# EAGLE design mbml (EAGLE 7.6.0)
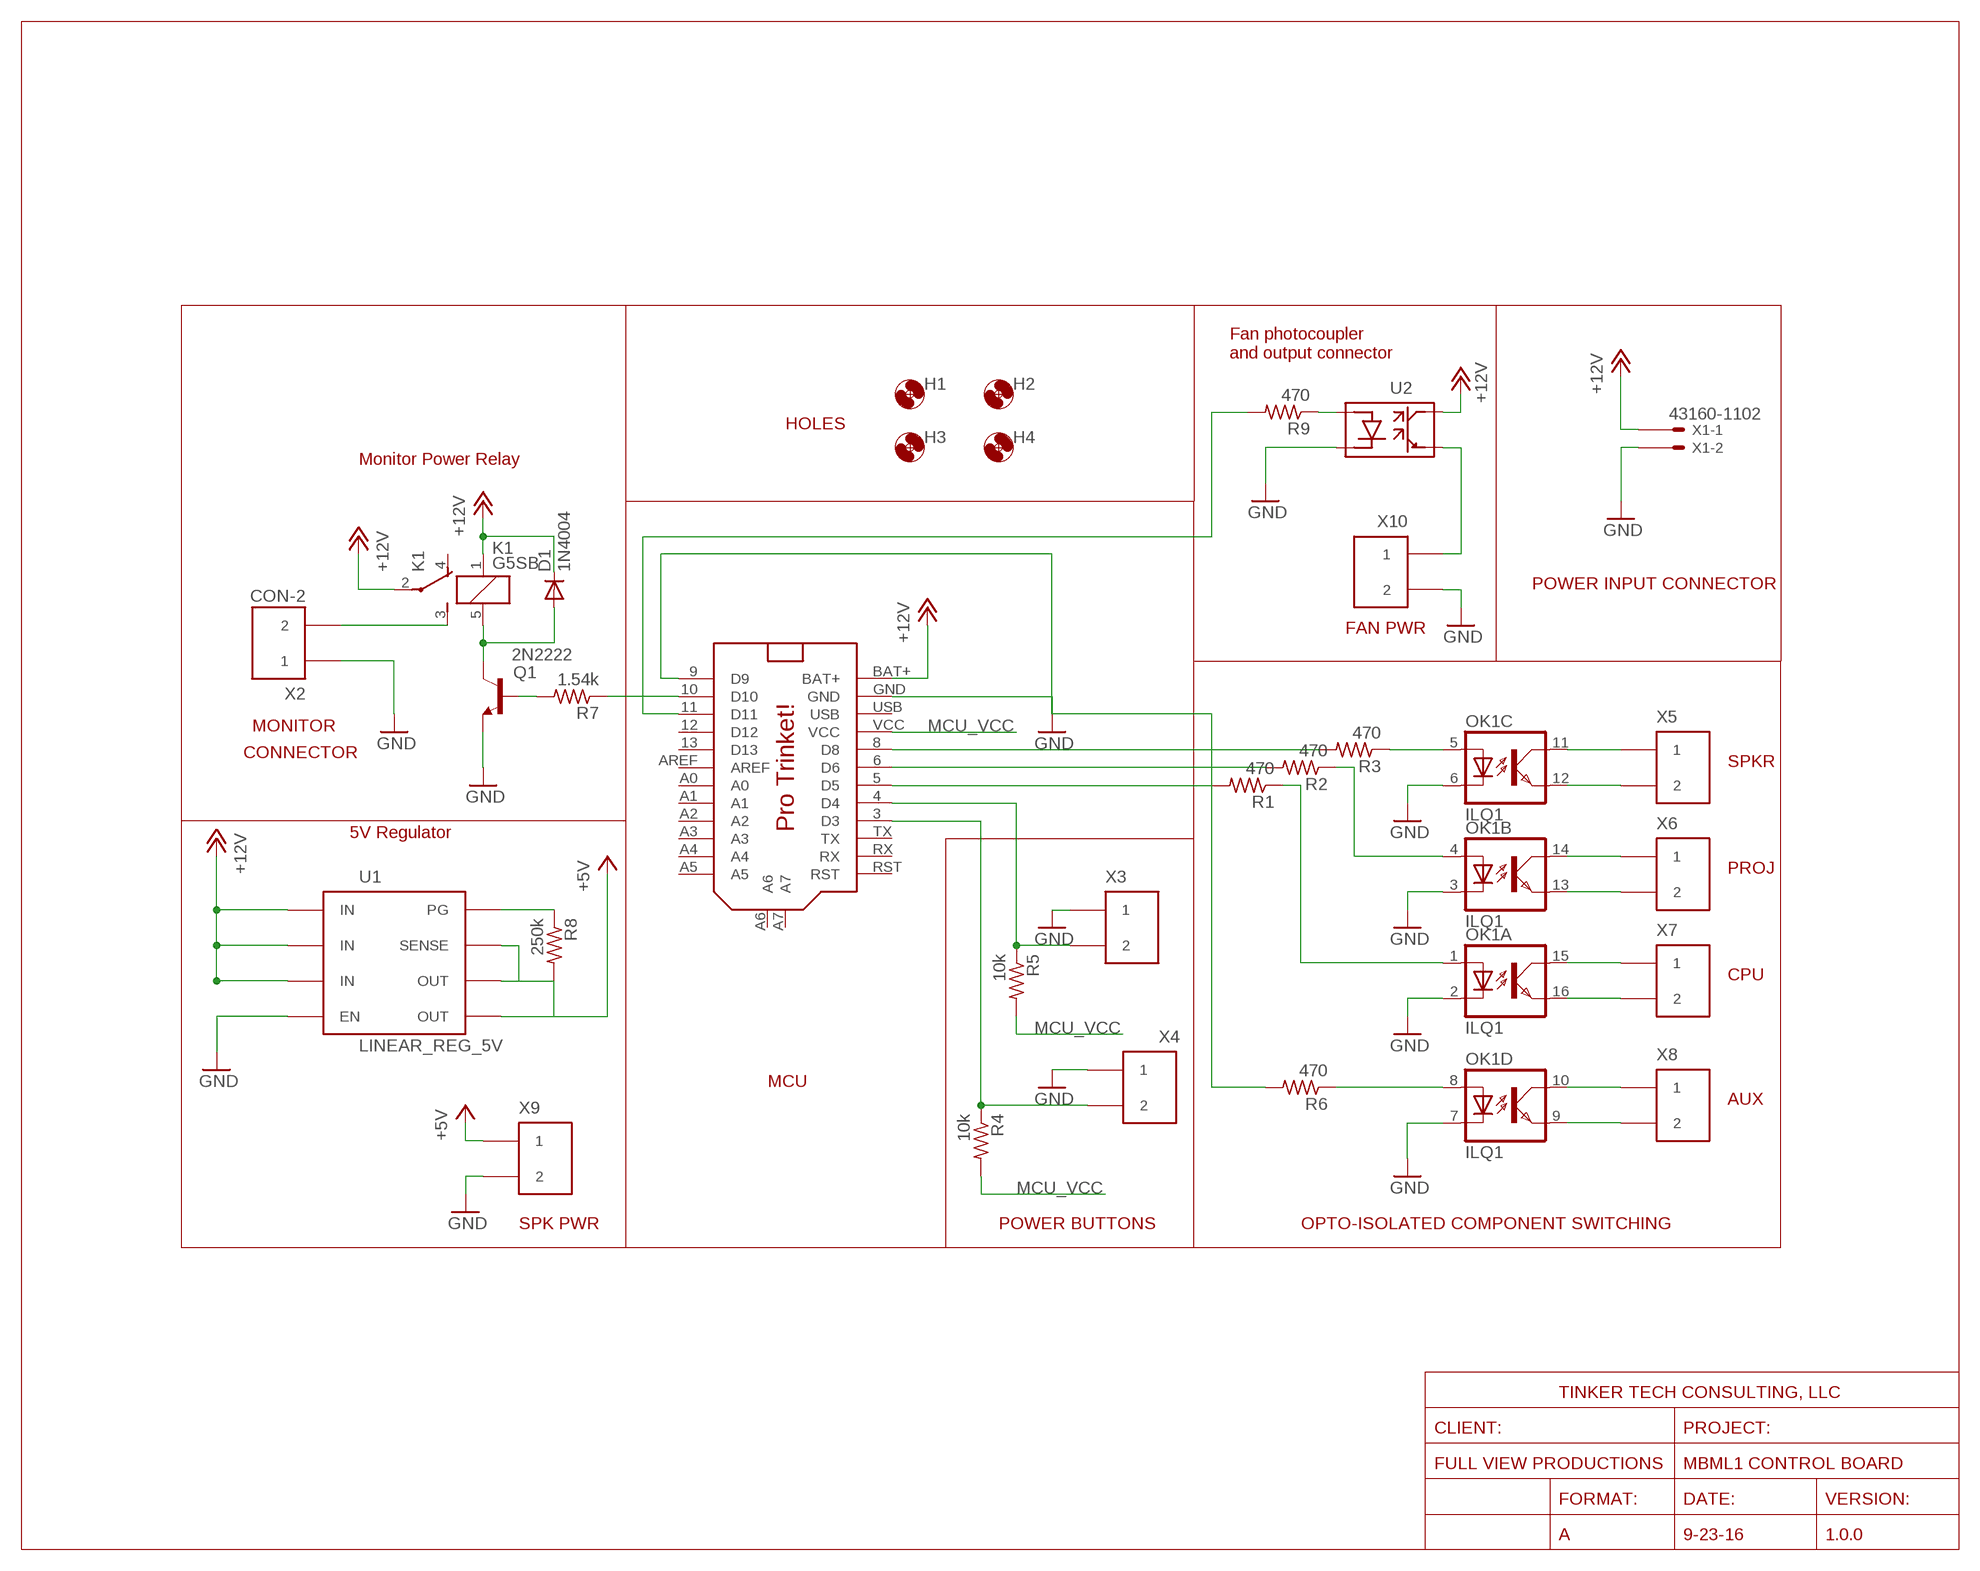
[diagram p0: schematic, sheet 1]

## Parts
D1  1N4004  [DO41-10]
H1  MOUNT-HOLE3.0  [3,0]
H2  MOUNT-HOLE3.0  [3,0]
H3  MOUNT-HOLE3.0  [3,0]
H4  MOUNT-HOLE3.0  [3,0]
K1  G5SB  [G5SB]
OK1  ILQ1  [DIL16]
Q1  2N2222  [TO18]
R1  470  R-US_0204/5  [0204/5]
R2  470  R-US_0204/5  [0204/5]
R3  470  R-US_0204/5  [0204/5]
R4  10k  R-US_0204/5  [0204/5]
R5  10k  R-US_0204/5  [0204/5]
R6  470  R-US_0204/5  [0204/5]
R7  1.54k  R-US_0204/5  [0204/5]
R8  250k  R-US_0204/5  [0204/5]
R9  470  R-US_0204/5  [0204/5]
U1  LINEAR_REG_5V  [DIP-8]
U2  PHOTOCOUPLER  [DIP-4]
U$1  PRO_TRINKET  [PROTRINKET]
X1  43160-1102  [43160-XX02]
X2  CON-2  [MOLEX_MEGA-FIT_2]
X3  CON-2B2B-XH-A(LF)(SN)  [CON_2-2.5MM_TH]
X4  CON-2B2B-XH-A(LF)(SN)  [CON_2-2.5MM_TH]
X5  CON-2B2B-XH-A(LF)(SN)  [CON_2-2.5MM_TH]
X6  CON-2B2B-XH-A(LF)(SN)  [CON_2-2.5MM_TH]
X7  CON-2B2B-XH-A(LF)(SN)  [CON_2-2.5MM_TH]
X8  CON-2B2B-XH-A(LF)(SN)  [CON_2-2.5MM_TH]
X9  CON-2B2B-XH-A(LF)(SN)  [CON_2-2.5MM_TH]
X10  CON-2B2B-XH-A(LF)(SN)  [CON_2-2.5MM_TH]

## Nets
+5V: R8.2 U1.5(OUT) U1.6(OUT) U1.7(SENSE) X9.P$1
+12V: D1.C K1.1 K1.2(U:P) U1.1(IN) U1.2(IN) U1.3(IN) U2.4 U$1.BAT+ X1.1@1(-1:S)
GND: OK1.2(A:C) OK1.3(B:C) OK1.6(C:C) OK1.7(D:C) Q1.1(E) U1.4(EN) U2.2 U$1.GND X1.2@1(-2:S) X2.P$1 X3.P$1 X4.P$1 X9.P$2 X10.P$2
MCU_VCC: R4.2 R5.2 U$1.VCC
MON_PWR: K1.3(U:S) X2.P$2
N$1: R4.1 U$1.3(D3) X4.P$2
N$2: R5.1 U$1.4(D4) X3.P$2
N$3: D1.A K1.5 Q1.3(C)
N$4: R1.2 U$1.5(D5)
N$5: Q1.2(B) R7.2
N$6: OK1.5(C:A) R3.1
N$7: OK1.4(B:A) R2.1
N$8: OK1.1(A:A) R1.1
N$9: R2.2 U$1.6(D6)
N$10: R3.2 U$1.8(D8)
N$11: OK1.11(C:COL) X5.P$1
N$12: OK1.12(C:EMIT) X5.P$2
N$13: OK1.14(B:COL) X6.P$1
N$14: OK1.13(B:EMIT) X6.P$2
N$15: OK1.15(A:COL) X7.P$1
N$16: OK1.16(A:EMIT) X7.P$2
N$17: OK1.8(D:A) R6.1
N$18: R6.2 U$1.9(D9)
N$19: OK1.10(D:COL) X8.P$1
N$20: OK1.9(D:EMIT) X8.P$2
N$35: R7.1 U$1.10(D10)
N$46: R9.1 U2.1
N$47: R9.2 U$1.11(D11)
N$48: R8.1 U1.8(PG)
N$49: U2.3 X10.P$1
Unconnected: K1.4(U:O) U$1.12(D12) U$1.13(D13) U$1.A0 U$1.A1 U$1.A2 U$1.A3 U$1.A4 U$1.A5 U$1.A6 U$1.A7 U$1.AREF U$1.RST U$1.RX U$1.TX X1.1@2(-1:S) X1.2@2(-2:S)

## Notes on the sheet
- Fan photocoupler
  and output connector
- HOLES
- Monitor Power Relay
- POWER INPUT CONNECTOR
- FAN PWR
- MONITOR
- CONNECTOR
- SPKR
- 5V Regulator
- PROJ
- CPU
- MCU
- AUX
- SPK PWR | POWER BUTTONS | OPTO-ISOLATED COMPONENT SWITCHING
- TINKER TECH CONSULTING, LLC
- CLIENT: | PROJECT:
- FULL VIEW PRODUCTIONS | MBML1 CONTROL BOARD
- FORMAT: | DATE: | VERSION:
- A | 9-23-16 | 1.0.0

## Power pins joined to a net without a drawn wire
USB: U$1.USB

## Library data of the parts
D1 = diode:1N4004: DIODE general purpose rectifier, 1 A
H1-H4 = holes:MOUNT-HOLE: MOUNTING HOLE with drill center marker
K1 = relay:G5SB: Compact Single-pole Relay for Switching 5 A Source: http://www.omron.com/ecb/products/pry/121/g5sb.html; OC_FARNELL: unknown; OC_NEWARK: unknown
OK1 = optocoupler:ILQ1: SIEMENS OPTO COUPLER; MF: VISHAY/TELEFUNKEN; MPN: ILQ1; OC_FARNELL: 1469501; OC_NEWARK: 88K1954
Q1 = transistor-npn:2N2222*: NPN Transistor
R1-R9 = resistor:R-US_: RESISTOR, American symbol
U1 = TinkerTech:LINEAR_REG_5V
U2 = TinkerTech:PHOTOCOUPLER
U$1 = adafruit_9-22-16:PRO_TRINKET
X1 = con-molex:43160-*02: SDA-43160 Connector Source: http://www.molex.com/pdm_docs/sd/431601306_sd.pdf; MF: WALDOM/MOLEX; MPN: 43160-1102; OC_FARNELL: unknown; OC_NEWARK: 54H0255
X2-X10 = FVP:CON-2

## Net classes
1 mon_pwr: width 1.27 mm, clearance 0.508 mm

## Board
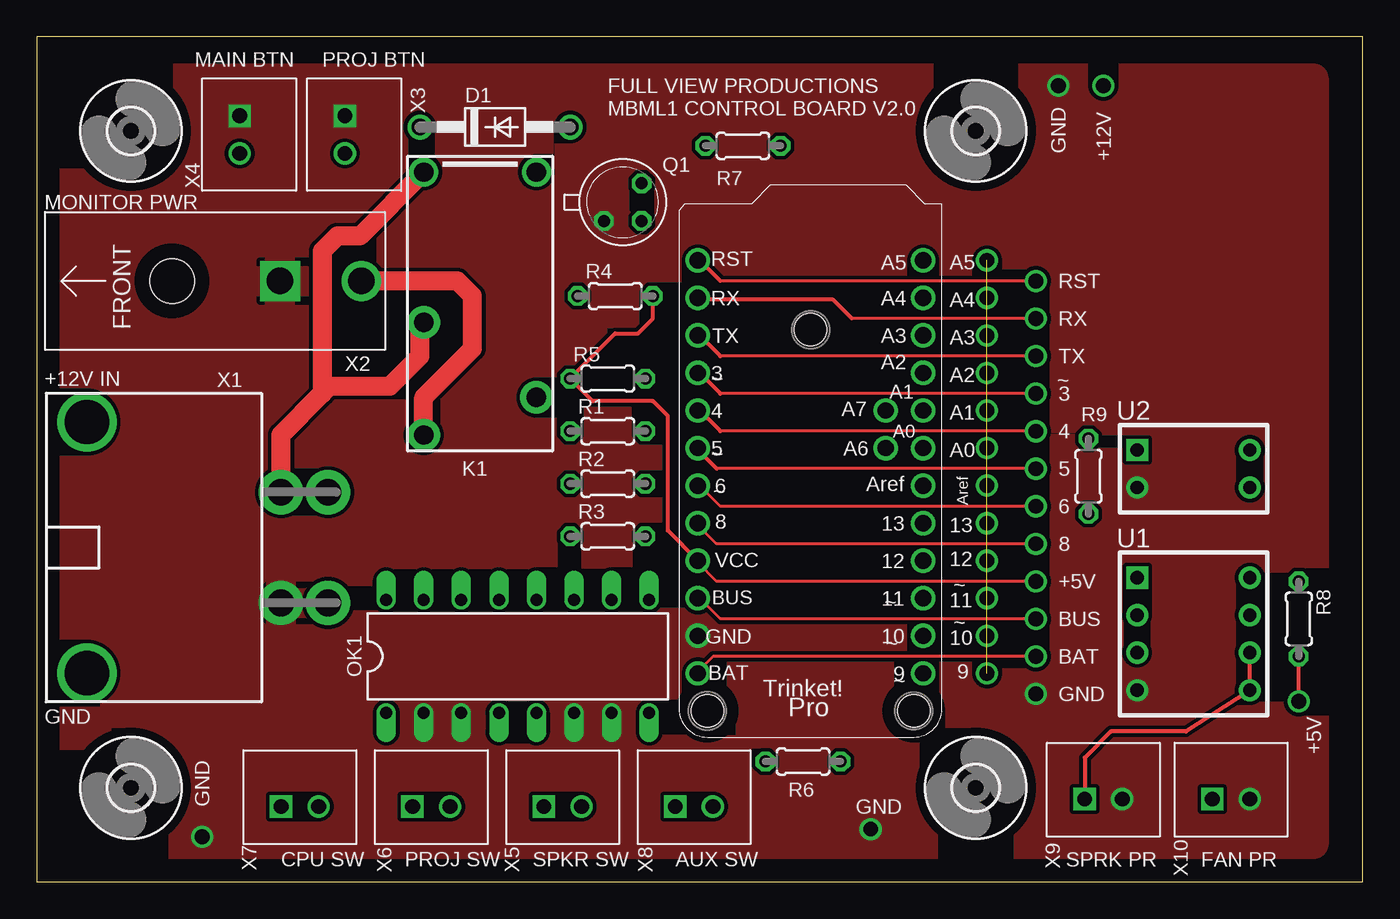
[diagram p1: board, top side]
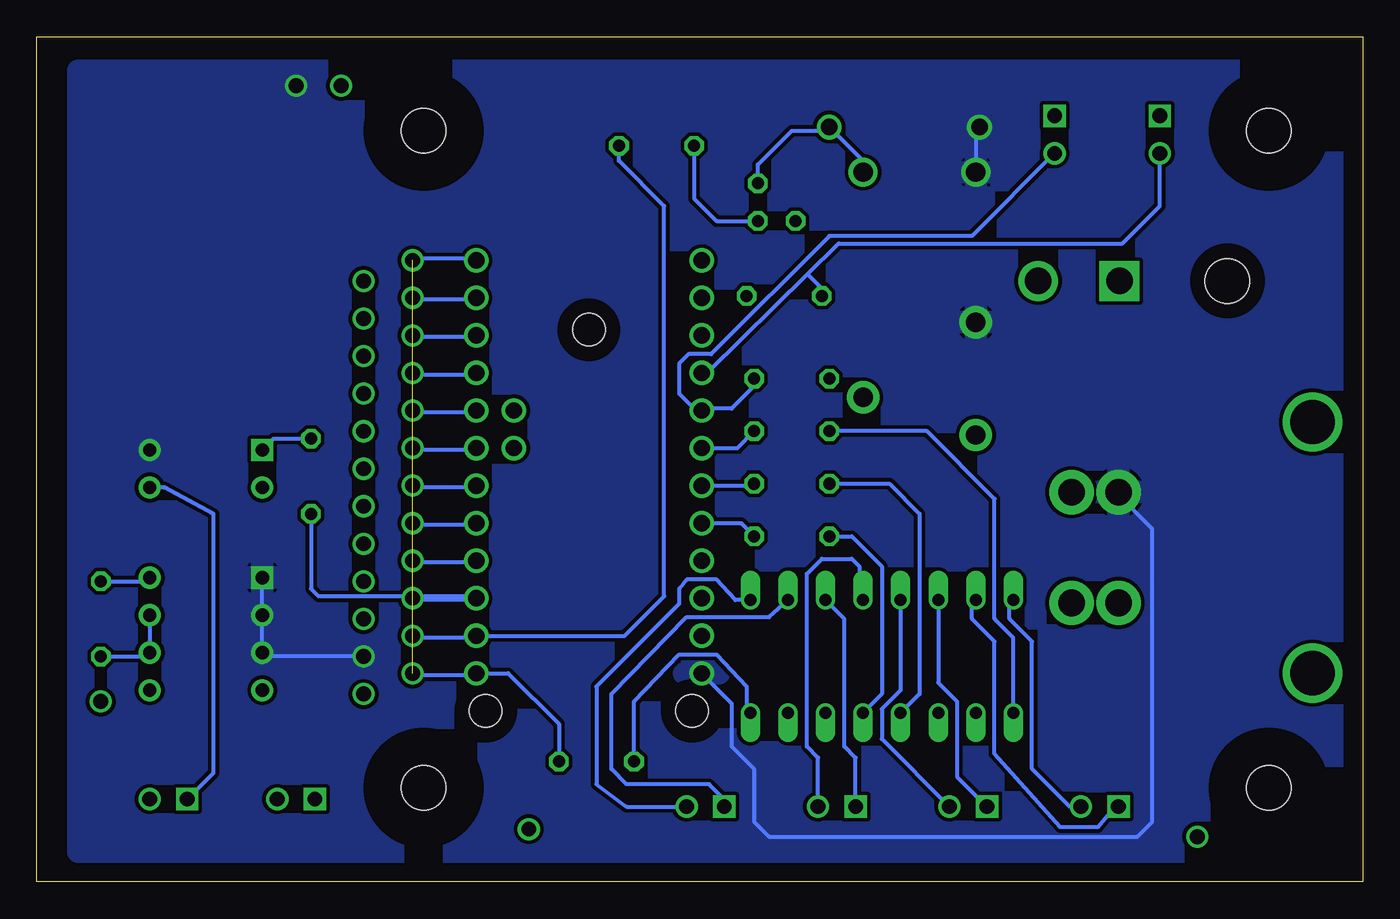
[diagram p2: board, bottom side, seen from below]

Size 89.66 x 57.15 mm. Coordinates in mm from the lower left corner, seen from the top.
Outline: 0,0 89.66,0 89.66,57.15 0,57.15 0,0
Copper layers (1*16): Top 0.035mm / dielectric 1.5mm / Bottom 0.035mm
Design rules "default *": minimum track width 8mil, minimum drill 24mil, track to track 10mil, track to pad 12mil, pad to pad 8mil, via to via 8mil, smd to smd 8mil, copper to edge 40mil, drill to drill 8mil, minimum pad ring 10mil, minimum via ring 8mil, stop-mask expansion 4mil, vias tented up to drill 0mil, thermal gap 10mil
tKeepout: 4 lines
bKeepout: 4 lines

### Footprints (pad centres in the part's own frame; a part is rotated, then mirrored left to right if it is on the bottom)
DO41-10 = drill 1.118: A 5.08,0; C -5.08,0
3,0 = hole 3: 0,0
G5SB = drill 1.3 pad 1.93: 1 7.62,3.81; 5 7.62,-3.81 | drill 1.3 pad 2.184: 2 -2.54,3.81; 3 -10.16,3.81; 4 -7.62,-3.81
DIL16 = drill 0.813 offset: 1 -8.89,-3.81; 2 -6.35,-3.81; 3 -3.81,-3.81; 4 -1.27,-3.81; 5 1.27,-3.81; 6 3.81,-3.81; 7 6.35,-3.81; 8 8.89,-3.81; 9 8.89,3.81; 10 6.35,3.81; 11 3.81,3.81; 12 1.27,3.81; 13 -1.27,3.81; 14 -3.81,3.81; 15 -6.35,3.81; 16 -8.89,3.81
TO18 = drill 0.813 octagon: 1 -1.27,-1.27; 2 1.27,-1.27; 3 1.27,1.27
0204/5 = drill 0.813 octagon: 1 -2.54,0; 2 2.54,0
DIP-8 = drill 0.9 pad 1.5 square: 1 -3.81,-3.81 | drill 0.9 pad 1.5: 2 -1.27,-3.81; 3 1.27,-3.81; 4 3.81,-3.81; 5 3.81,3.81; 6 1.27,3.81; 7 -1.27,3.81; 8 -3.81,3.81
DIP-4 = drill 0.9 pad 1.5 square: 1 -1.27,-3.81 | drill 0.9 pad 1.5: 2 1.27,-3.81; 3 1.27,3.81; 4 -1.27,3.81
PROTRINKET = drill 1.1: 3 7.62,2.921; 4 7.62,5.461; 5 7.62,8.001; 6 7.62,10.541; 8 7.62,13.081; 9 -7.62,23.241; 10 -7.62,20.701; 11 -7.62,18.161; 12 -7.62,15.621; 13 -7.62,13.081; A0 -7.62,8.001; A1 -7.62,5.461; A2 -7.62,2.921; A3 -7.62,0.381; A4 -7.62,-2.159; A5 -7.62,-4.699; A6 -5.08,8.001; A7 -5.08,5.461; AREF -7.62,10.541; BAT+ 7.62,23.241; GND 7.62,20.701; RST 7.62,-4.699; RX 7.62,-2.159; TX 7.62,0.381; USB 7.62,18.161; VCC 7.62,15.621 | hole 2.2: -6.985,25.781; 6.985,25.781; 0,0
43160-XX02 = drill 1.8 pad 3: 1@1 -3.745,0; 1@2 -3.745,3.18; 2@1 3.745,0; 2@2 3.745,3.18 | drill 3 pad 3.4: M1 -8.495,-13.13; M2 8.495,-13.13
MOLEX_MEGA-FIT_2 = drill 1.8 square: P$1 0,7.3 | drill 1.8: P$2 0,12.8 | hole 3: 0,0
CON_2-2.5MM_TH = drill 1 square: P$1 -1.27,0 | drill 1: P$2 1.27,0

### Placement (x,y rotation side)
D1  30.99,51.05 0 top
H1  6.35,6.35 0 top
H2  63.5,50.8 0 top
H3  6.35,50.8 0 top
H4  63.5,6.35 0 top
K1  29.97,40.39 90 top
OK1  32.51,15.24 0 top
Q1  39.62,45.97 0 top
R1  38.61,30.48 0 top
R2  38.61,26.92 0 top
R3  38.61,23.37 0 top
R4  39.12,39.62 0 top
R5  38.61,34.04 180 top
R6  51.82,8.13 0 top
R7  47.75,49.78 180 top
R8  85.34,17.78 270 top
R9  71.12,27.43 270 top
U1  78.23,16.76 270 top
U2  78.23,27.94 270 top
U$1  52.32,37.34 180 top
X1  16.51,22.61 270 top
X2  9.14,40.64 270 top
X3  20.83,50.55 270 top
X4  13.72,50.55 270 top
X5  35.56,5.08 0 top
X6  26.67,5.08 0 top
X7  17.78,5.08 0 top
X8  44.45,5.08 0 top
X9  72.14,5.59 0 top
X10  80.77,5.59 0 top

### Tracks (layer width: path | path; a pad name or v marks a point on that pad's centre or on a via)
+5V  (via drill 1)
  Top 0.254: U1.6 U1.5 77.72,10.16 72.64,10.16 70.87,8.38 X9.P$1 | v85.34,12.19 R8.2
  Bottom 0.254: U1.7 U1.6 82.3,15.24 R8.2
+12V  (via drill 1)
  Top 0.203: v67.56,15.24 45.72,15.24 44.7,14.22
  Top 1.27: X1.1@1 16.51,30.23 19.3,33.02 | 19.3,33.02 19.81,33.53 23.88,33.53 25.91,35.56 25.91,37.59 K1.2 | K1.1 21.84,43.69 20.32,43.69 19.3,42.67 19.3,33.02
  Bottom 0.254: U$1.BAT+ 42.67,12.06 42.67,9.14 41.15,7.62 41.15,4.06 40.13,3.05 15.24,3.05 14.22,4.06 14.22,23.88 16.7,26.35 X1.1@1 | D1.C 26.16,50.8 K1.1 | 74.68,20.83 U1.1 U1.2 U1.3 74.17,15.24 v67.56,15.24
  other vias: 72.14,53.85
  pour Bottom: 2.03,54.86 86.87,54.86 86.87,2.03 2.03,2.03
GND  (via drill 1)
  other vias: 56.39,3.56 11.18,3.05 69.09,53.85 67.56,12.7
  pour Top: 2.54,54.36 86.36,54.36 86.36,2.54 2.54,2.54
MCU_VCC
  Top 0.254: R4.2 41.66,38.1 40.64,37.08 39.12,37.08 R5.2 37.59,32.51 41.66,32.51 42.67,31.5 42.67,23.75 U$1.VCC
MON_PWR
  Top 1.27: K1.3 26.16,32.77 29.46,36.07 29.46,39.62 28.45,40.64 X2.P$2
N$1
  Bottom 0.254: U$1.3 44.32,34.42 44.2,34.54 37.54,41.1 | 37.54,41.1 35.43,43.18 16.26,43.18 13.72,45.72 X4.P$2 | R4.1 36.58,40.14 37.54,41.1
N$2
  Bottom 0.254: X3.P$2 26.42,43.69 36.07,43.69 44.07,35.69 45.59,35.69 46.23,35.05 46.23,33.02 45.09,31.88 U$1.4 44.58,32 42.67,32 41.15,33.53 R5.1
N$3
  Bottom 0.254: K1.5 33.78,48.77 D1.A 36.32,50.8 38.61,50.8 40.89,48.51 Q1.3
N$4
  Bottom 0.254: U$1.5 42.29,29.34 R1.2
N$5
  Bottom 0.254: R7.2 45.21,46.23 43.69,44.7 Q1.2
N$6
  Bottom 0.254: R3.1 34.54,23.37 32.51,21.34 32.51,12.7 OK1.5
N$7
  Bottom 0.254: R2.1 32,26.92 29.97,24.89 29.97,12.7 OK1.4
N$8
  Bottom 0.254: OK1.1 23.62,16.51 24.89,17.78 24.89,25.91 29.46,30.48 R1.1
N$9
  Bottom 0.254: U$1.6 41.27,26.8 R2.2
N$10
  Bottom 0.254: U$1.8 42.04,24.26 R3.2
N$11
  Bottom 0.254: X5.P$1 34.29,8.38 35.05,9.14 35.05,17.78 OK1.11
N$12
  Bottom 0.254: X5.P$2 36.83,8.38 37.59,9.14 37.59,20.83 36.58,21.84 34.54,21.84 34.04,21.34 34.04,19.3 OK1.12
N$13
  Bottom 0.254: OK1.14 28.7,13.46 27.43,12.19 27.43,7.11 X6.P$1
N$14
  Bottom 0.254: OK1.13 31.24,12.95 32.51,11.68 32.51,9.65 X6.P$2
N$15
  Bottom 0.254: X7.P$1 16.76,5.08 17.91,3.68 20.45,3.68 24.89,8.64 24.89,16.26 26.42,17.78 26.42,18.8 OK1.15
N$16
  Bottom 0.254: X7.P$2 19.81,5.08 22.35,7.62 22.35,16.26 23.88,17.78 23.88,18.8 OK1.16
N$17
  Bottom 0.254: R6.1 49.28,12.19 46.23,15.37 43.69,15.37 41.66,13.21 41.66,11.68 OK1.8
N$18
  Bottom 0.254: U$1.9 57.78,14.1 54.36,10.67 R6.2
N$19
  Bottom 0.254: X8.P$1 43.18,5.59 44.2,6.6 49.78,6.6 50.8,7.62 50.8,12.7 45.72,17.91 40.13,17.91 OK1.10
N$20
  Bottom 0.254: OK1.9 42.42,19.05 43.69,20.45 45.72,20.45 46.23,19.81 46.23,18.8 51.82,13.21 51.82,6.6 49.78,5.08 X8.P$2
N$21  (via drill 1)  (11 unrouted)
  other vias: 64.26,42.04 64.26,39.5 64.26,36.96 64.26,34.42 64.26,31.88 64.26,29.34 64.26,26.8 64.26,24.26 64.26,21.72 64.26,19.18 64.26,16.64 64.26,14.1
N$22
  Bottom 0.254: 59.94,42.16 64.01,42.16 64.26,41.91
N$23
  Bottom 0.254: 59.94,39.37 64.01,39.37 64.26,39.62
N$24
  Bottom 0.254: 59.94,36.83 64.01,36.83 64.26,37.08
N$25
  Bottom 0.254: 59.94,34.29 64.01,34.29 64.26,34.54
N$26
  Bottom 0.254: 59.94,31.75 64.26,31.75
N$27
  Bottom 0.254: 59.94,29.21 64.26,29.21
N$28
  Bottom 0.254: 59.94,26.67 64.26,26.67
N$29
  Bottom 0.254: 59.94,24.13 64.26,24.13
N$30
  Bottom 0.254: 59.94,21.59 64.26,21.59
N$31
  Bottom 0.254: 59.94,19.05 64.26,19.05
N$32
  Bottom 0.254: 60.2,16.51 64.01,16.51 64.26,16.76
N$33
  Bottom 0.254: 60.2,13.97 64.01,13.97 64.26,14.22
N$34  (via drill 1)
  Top 0.203: v67.56,17.78 46.23,17.78 44.7,19.3
N$35
  Bottom 0.254: U$1.10 49.91,16.64 47.24,19.3 47.24,45.72 50.29,48.77 R7.1
N$37  (via drill 1)
  Top 0.203: v67.56,20.32 45.97,20.32 44.7,21.59
N$38  (via drill 1)
  Top 0.203: v67.56,22.86 45.97,22.86 44.96,23.88
N$39  (via drill 1)
  Top 0.203: v67.56,25.4 46.23,25.4 44.96,26.67
N$40  (via drill 1)
  Top 0.203: v67.56,27.94 45.97,27.94
  Top 0.254: 45.97,27.94 44.7,29.21
N$41  (via drill 1)
  Top 0.203: v67.56,30.48 46.23,30.48
  Top 0.254: 46.23,30.48 44.7,32
N$42  (via drill 1)
  Top 0.203: v67.56,33.02 46.23,33.02
  Top 0.254: 46.23,33.02 44.7,34.54
N$43  (via drill 1)
  Top 0.203: v67.56,35.56 46.23,35.56
  Top 0.254: 46.23,35.56 44.7,37.08
N$44  (via drill 1)
  Top 0.203: v67.56,38.1 55.12,38.1
  Top 0.254: 55.12,38.1 53.85,39.37 44.7,39.37
N$45  (via drill 1)
  Top 0.203: v67.56,40.64 46.23,40.64
  Top 0.254: 46.23,40.64 44.7,42.16
N$46
  Bottom 0.254: U2.1 73.66,29.97 R9.1
N$47
  Bottom 0.254: R9.2 71.12,19.81 70.61,19.3 60.07,19.3 U$1.11
N$48
  Bottom 0.254: R8.1 82.3,20.32 U1.8
N$49
  Bottom 0.254: X10.P$1 77.72,7.37 77.72,24.89 81.03,26.67 U2.3

### Text on the board
tPlace: +12V | +5V | SPRK PR | FAN PR
tNames: MAIN BTN | PROJ BTN | FULL VIEW PRODUCTIONS | MBML1 CONTROL BOARD V2.0 | GND | MONITOR PWR | A5 | RST | A4 | RX | A3 | X2 | TX | +12V IN | A2 | ~ | 3 | A1 | 4 | A0 | Aref | 5 | 6 | 13 | 8 | 12 | ~ | +5V | 11 | ~ | BUS | 10 | BAT | 9 | GND | GND | GND | GND | CPU SW | PROJ SW | SPKR SW | AUX SW